# Altium schematic sheet Sheet1.SchDoc
size A; SheetNumber: 1; SheetTotal: 1
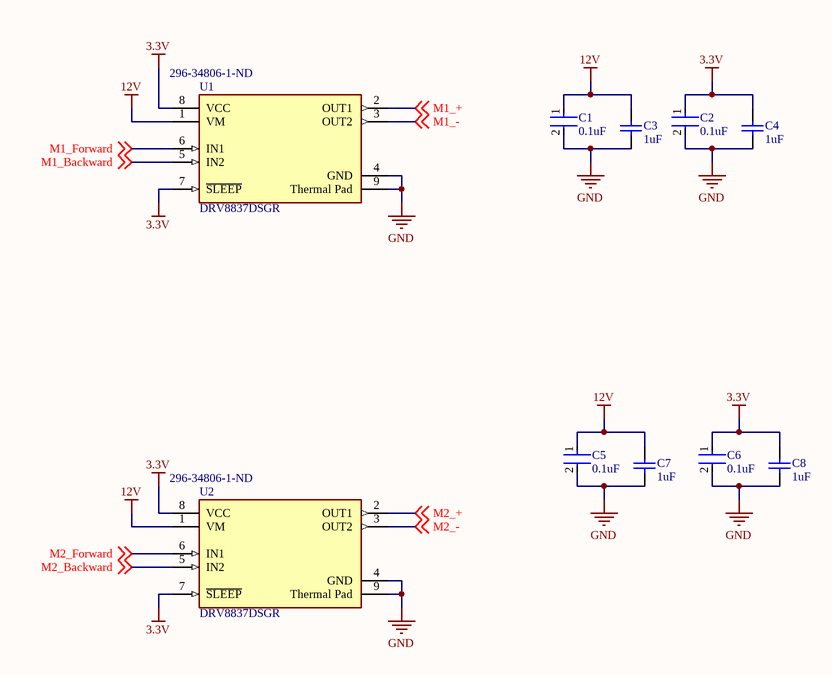
[diagram p0: Sheet1.SchDoc]

## Parts
C1  0.1uF  [FP-CC0805-0_85-MFG]
C2  0.1uF  [FP-CC0805-0_85-MFG]
C3  1uF  [CAPC2013X145X50ML20T25]
C4  1uF  [CAPC2013X145X50ML20T25]
C5  0.1uF  [FP-CC0805-0_85-MFG]
C6  0.1uF  [FP-CC0805-0_85-MFG]
C7  1uF  [CAPC2013X145X50ML20T25]
C8  1uF  [CAPC2013X145X50ML20T25]
U1  DRV8837DSGR  Supplier Part Number 1: 296-34806-1-ND  [FP-DSG0008A-MFG]
U2  DRV8837DSGR  Supplier Part Number 1: 296-34806-1-ND  [FP-DSG0008A-MFG]

## Nets
3.3V: C2.1 C4.2 C6.1 C8.2 U1.7(~{SLEEP}) U1.8(VCC) U2.7(~{SLEEP}) U2.8(VCC)
12V: C1.1 C3.2 C5.1 C7.2 U1.1(VM) U2.1(VM)
GND: C1.2 C2.2 C3.1 C4.1 C5.2 C6.2 C7.1 C8.1 U1.4(GND) U1.9(Thermal_Pad) U2.4(GND) U2.9(Thermal_Pad)
M1_+: U1.2(OUT1) ; off-sheet M1_+
M1_-: U1.3(OUT2) ; off-sheet M1_-
M1_Backward: U1.5(IN2) ; off-sheet M1_Backward
M1_Forward: U1.6(IN1) ; off-sheet M1_Forward
M2_+: U2.2(OUT1) ; off-sheet M2_+
M2_-: U2.3(OUT2) ; off-sheet M2_-
M2_Backward: U2.5(IN2) ; off-sheet M2_Backward
M2_Forward: U2.6(IN1) ; off-sheet M2_Forward

## Library data of the parts
C1 C2 C5 C6 = CMP-1036-04410-2: CAP CER 0.1UF 25V X7R 0805; Manufacturer Part Number: CC0805KRX7R8BB104; Manufacturer: Yageo; Tolerance: 0.1; Material: Ceramic; Value: 100 nF; Insulation Resistance: 100GR; ComponentLink2URL: http://www.yageo.com/documents/recent/UPY-GPHC_Y5V_6.3V-to-50V_8.pdf; Category: Cap; Mouser Description: Multilayer Ceramic Capacitors MLCC - SMD/SMT 100nF 25V X7R 10%; Device Class L1: Passive Components; Footprint Url: http://www.yageo.com/exep/pages/download/literatures/UPY-C_GEN_24.pdf; Height: 0.95mm; Digikey Description: CAP CER 0.1UF 25V X7R 0805; Lead Free: Yes; Temperature Range High: +85°C; Temperature: -30°C to +85°C; Ipc Land Pattern Name: CAPC200125X85; Capacitance: 100 nF; Automotive: No; Octopart: https://octopart.com/cc0805krx7r8bb104-yageo-39467766; Device Class L2: Capacitors; Temperature Characteristic: X7R; Voltage Rating: 25 V; ComponentLink2Description: Datasheet; Temperature Range Low: -30°C; Device Class L3: Ceramic Capacitors; RoHS: TRUE; Package: CC0805-0.85; Supplier 1: Digi-Key; Supplier Part Number 1: 311-1141-1-ND; Stock 1: 1013369; Pricing 1: 1=0.11000, 10=0.07700, 50=0.04380, 100=0.03620, 500=0.02542, 1000=0.02104 (USD); Mount: Surface Mount; Case/Package: 0805; Number of Pins: 2; Case Code (Metric): 2012; Case Code (Imperial): 0805; Min Operating Temperature: -55°C; Max Operating Temperature: 125°C; Packaging: Tape and Reel; Voltage Rating (DC): 25V; Dielectric: X7R; Package Quantity: 4000; Termination: SMD/SMT; Series: CC; Resistor Type: Ceramic; Length: 2mm; Width: 1.25mm; Depth: 1.25mm; Thickness: 0.033inch; Radiation Hardening: No; RoHS Compliant: Yes; Reach SVHC Compliant: Yes; Halogen Free: Halogen Free; ComponentLink1URL: https://datasheet.ciiva.com/8034/70765-8034031.pdf?src-supplier=Element14; ComponentLink1Description: https://datasheet.ciiva.com/8034/70765-8034031.pdf?src-supplier=Element14; ComponentLink3URL: https://datasheet.ciiva.com/28450/1489800-28450789.pdf?src-supplier=Element14; ComponentLink3Description: https://datasheet.ciiva.com/28450/1489800-28450789.pdf?src-supplier=Element14; ComponentLink4URL: https://datasheet.ciiva.com/46430/1850775-46430166.pdf?src-supplier=Element14; ComponentLink4Description: https://datasheet.ciiva.com/46430/1850775-46430166.pdf?src-supplier=Element14; ComponentLink5URL: https://datasheet.ciiva.com/145/mlccorderingcode-145008.pdf?src-supplier=Digi-Key; ComponentLink5Description: https://datasheet.ciiva.com/145/mlccorderingcode-145008.pdf?src-supplier=Digi-Key; ComponentLink6URL: https://datasheet.ciiva.com/145/mlccorderingcode-145007.pdf?src-supplier=Digi-Key; ComponentLink6Description: https://datasheet.ciiva.com/145/mlccorderingcode-145007.pdf?src-supplier=Digi-Key; ComponentLink7URL: https://datasheet.ciiva.com/145/mlccorderingcode-145009.pdf?src-supplier=Digi-Key; ComponentLink7Description: https://datasheet.ciiva.com/145/mlccorderingcode-145009.pdf?src-supplier=Digi-Key; ComponentLink8URL: https://datasheet.ciiva.com/8034/1784427-8034030.pdf?src-supplier=Element14; ComponentLink8Description: https://datasheet.ciiva.com/8034/1784427-8034030.pdf?src-supplier=Element14
C3 C4 C7 C8 = CMP-1036-04757-2: Part Number: CC0805ZRY5V8BB105; Manufacturer: Yageo; Voltage Rating: 25V; Tolerance: 80%; Dielectric: Y5V; Supplier 1: Digi-Key; Supplier Part Number 1: 311-1358-1-ND; Manufacturer Part Number: CC0805ZRY5V8BB105; RoHS: Yes; Category: Ceramic Capacitors; Stock 1: 286163; Pricing 1: 1=0.13000, 10=0.09000, 50=0.05100, 100=0.04230, 500=0.02966, 1000=0.02456 (USD); Mount: Surface Mount; Case/Package: 0805; Case Code (Metric): 2012; Case Code (Imperial): 0805; Weight: 0.000194oz; Min Operating Temperature: -30°C; Max Operating Temperature: 85°C; Package Quantity: 1; Capacitance: 1uF; Packaging: Tape and Reel; Voltage Rating (DC): 25V; Termination: SMD/SMT; Series: CC; Resistor Type: Ceramic; Length: 2mm; Width: 1.25mm; Height: 0.85mm; Thickness: 0.033inch; Depth: 1.25mm; Radiation Hardening: No; RoHS Compliant: Yes; Reach SVHC Compliant: Yes; Lead Free: Lead Free; Halogen Free: Halogen Free; ComponentLink1URL: https://datasheet.ciiva.com/144/mlccorderingcode-144703.pdf?src-supplier=Digi-Key; ComponentLink1Description: https://datasheet.ciiva.com/144/mlccorderingcode-144703.pdf?src-supplier=Digi-Key; ComponentLink2URL: https://datasheet.ciiva.com/26863/getdatasheetpartid-419810-26863011.pdf?src-supplier=Verical; ComponentLink2Description: https://datasheet.ciiva.com/26863/getdatasheetpartid-419810-26863011.pdf?src-supplier=Verical; ComponentLink3URL: https://datasheet.ciiva.com/28450/1132289-28450860.pdf?src-supplier=Element14; ComponentLink3Description: https://datasheet.ciiva.com/28450/1132289-28450860.pdf?src-supplier=Element14; ComponentLink4URL: https://datasheet.ciiva.com/144/mlccorderingcode-144704.pdf?src-supplier=Digi-Key; ComponentLink4Description: https://datasheet.ciiva.com/144/mlccorderingcode-144704.pdf?src-supplier=Digi-Key; ComponentLink5URL: https://datasheet.ciiva.com/144/mlccorderingcode-144705.pdf?src-supplier=Digi-Key; ComponentLink5Description: https://datasheet.ciiva.com/144/mlccorderingcode-144705.pdf?src-supplier=Digi-Key; ComponentLink6URL: https://datasheet.ciiva.com/13208/upy-gp-np0-16v-to-50v-8-13208251.pdf?src-supplier=Mouser; ComponentLink6Description: https://datasheet.ciiva.com/13208/upy-gp-np0-16v-to-50v-8-13208251.pdf?src-supplier=Mouser
U1 U2 = CMP-04915-000004-1: IC MOTOR DRIVER PAR 8WSON; Manufacturer: Texas Instruments; Switching Frequency: 0-250kHz; Min Supply Voltage: 1.8V; Standoff Height: 0mm; Max Supply Voltage: 7V; Output Voltage: 0-11V; Motor Type: Brushed; Number Of Outputs: 2; Output Current: 1.8A; Max Junction Temp: +150°C; Nominal Supply Current: 300-700uA; Interface: PWM; Fault Protection: Over Temperature,Short Circuit; Supply Current: 300uA; Mouser Description: Motor / Motion / Ignition Controllers & Drivers 1.8A Low Vltg Brush DC Motor Driver; Device Class L2: Power Management ICs; Manufacturer Part Number: DRV8837DSGR; Temperature Range Low: -40°C; Lead Free: Yes; Height: 0.8mm; Device Class L3: Motor Drivers; Octopart: https://octopart.com/drv8837dsgr-texas+instruments-23786726; Package: DSG0008A; ComponentLink2URL: http://www.ti.com/lit/ds/symlink/drv8837.pdf; Temperature: -40°C to +85°C; Ambient Temperature Range Low: -40°C; ComponentLink2Description: Datasheet; Ambient Temperature Range High: +85°C; Device Class L1: Integrated Circuits (ICs); Category: IC; Temperature Range High: +85°C; RoHS: TRUE; Automotive: No; Digikey Description: IC MOTOR DRIVER PAR 8WSON; Supplier 1: Digi-Key; Stock 1: 52410; Pricing 1: 1=1.21000, 10=1.08500, 25=1.03000, 100=0.84600, 250=0.79080, 500=0.69886, 1000=0.55173 (USD); Mount: Surface Mount; Number of Pins: 8; Min Operating Temperature: -40°C; Max Operating Temperature: 85°C; Packaging: Tape and Reel; Package Quantity: 3000; Series: -; Type: Integrated Circuit (IC); Max Output Current: 1.8A; Technology: NMOS; Radiation Hardening: No; Reach SVHC Compliant: Yes; RoHS Compliant: Yes; ComponentLink1URL: https://datasheet.ciiva.com/15109/getdatasheetpartid-543738-15109646.pdf?src-supplier=Verical; ComponentLink1Description: https://datasheet.ciiva.com/15109/getdatasheetpartid-543738-15109646.pdf?src-supplier=Verical; ComponentLink3URL: https://datasheet.ciiva.com/6602/drv8837-6602821.pdf?src-supplier=Digi-Key; ComponentLink3Description: https://datasheet.ciiva.com/6602/drv8837-6602821.pdf?src-supplier=Digi-Key